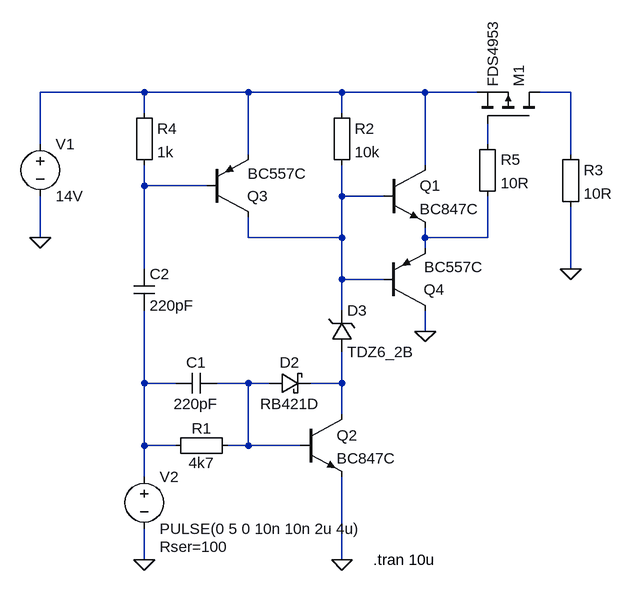
[diagram p0: schematic P-channel MOSFET shift_4_4_bjts.asc]
P-channel MOSFET shift_4_4_bjts.asc, the LTspice schematic file:
Version 4
SHEET 1 1044 680
WIRE -240 -144 -400 -144
WIRE -80 -144 -240 -144
WIRE 64 -144 -80 -144
WIRE 192 -144 64 -144
WIRE 272 -144 192 -144
WIRE 416 -144 368 -144
WIRE -240 -112 -240 -144
WIRE 64 -112 64 -144
WIRE -400 -64 -400 -144
WIRE 288 -64 288 -96
WIRE -80 -48 -80 -144
WIRE 416 -48 416 -144
WIRE 192 -32 192 -144
WIRE -240 0 -240 -32
WIRE -144 0 -240 0
WIRE 64 16 64 -32
WIRE 128 16 64 16
WIRE -400 80 -400 16
WIRE -80 80 -80 48
WIRE 64 80 64 16
WIRE 64 80 -80 80
WIRE 192 80 192 64
WIRE 288 80 288 16
WIRE 288 80 192 80
WIRE 192 96 192 80
WIRE -240 128 -240 0
WIRE 416 128 416 32
WIRE 64 144 64 80
WIRE 128 144 64 144
WIRE 64 192 64 144
WIRE 192 224 192 192
WIRE -240 304 -240 192
WIRE -192 304 -240 304
WIRE -80 304 -128 304
WIRE -48 304 -80 304
WIRE 64 304 64 256
WIRE 64 304 16 304
WIRE 64 352 64 304
WIRE -240 400 -240 304
WIRE -192 400 -240 400
WIRE -80 400 -80 304
WIRE -80 400 -112 400
WIRE 0 400 -80 400
WIRE -240 448 -240 400
WIRE -240 576 -240 528
WIRE 64 576 64 448
FLAG -400 80 0
FLAG 416 128 0
FLAG -240 576 0
FLAG 64 576 0
FLAG 192 224 0
SYMBOL npn 128 -32 R0
SYMATTR InstName Q1
SYMATTR Value BC847C
SYMBOL Misc\\EuropeanResistor 48 -128 R0
SYMATTR InstName R2
SYMATTR Value 10k
SYMBOL voltage -400 -80 R0
WINDOW 123 0 0 Left 2
WINDOW 39 0 0 Left 2
SYMATTR InstName V1
SYMATTR Value 14V
SYMBOL pmos 368 -96 M270
SYMATTR InstName M1
SYMATTR Value FDS4953
SYMBOL Misc\\EuropeanResistor 400 -64 R0
SYMATTR InstName R3
SYMATTR Value 10R
SYMBOL voltage -240 432 R0
WINDOW 123 0 0 Left 2
WINDOW 39 24 124 Left 2
SYMATTR SpiceLine Rser=100
SYMATTR InstName V2
SYMATTR Value PULSE(0 5 0 10n 10n 2u 4u)
SYMBOL zener 48 256 M180
WINDOW 0 24 64 Left 2
WINDOW 3 24 0 Left 2
SYMATTR InstName D3
SYMATTR Value TDZ6_2B
SYMATTR Description Diode
SYMATTR Type diode
SYMBOL npn 0 352 R0
SYMATTR InstName Q2
SYMATTR Value BC847C
SYMBOL Misc\\EuropeanResistor -96 384 R90
WINDOW 0 5 56 VBottom 2
WINDOW 3 27 56 VTop 2
SYMATTR InstName R1
SYMATTR Value 4k7
SYMBOL schottky -48 320 R270
WINDOW 0 32 32 VTop 2
WINDOW 3 0 32 VBottom 2
SYMATTR InstName D2
SYMATTR Value RB421D
SYMATTR Description Diode
SYMATTR Type diode
SYMBOL cap -128 288 R90
WINDOW 0 0 32 VBottom 2
WINDOW 3 32 32 VTop 2
SYMATTR InstName C1
SYMATTR Value 220pF
SYMBOL pnp -144 48 M180
WINDOW 0 62 32 Left 2
WINDOW 3 63 67 Left 2
SYMATTR InstName Q3
SYMATTR Value BC557C
SYMBOL Misc\\EuropeanResistor -256 -128 R0
SYMATTR InstName R4
SYMATTR Value 1k
SYMBOL cap -256 128 R0
SYMATTR InstName C2
SYMATTR Value 220pF
SYMBOL pnp 128 192 M180
WINDOW 0 62 32 Left 2
WINDOW 3 63 67 Left 2
SYMATTR InstName Q4
SYMATTR Value BC557C
SYMBOL Misc\\EuropeanResistor 272 -80 R0
SYMATTR InstName R5
SYMATTR Value 10R
TEXT 112 576 Left 2 !.tran 10u

The netlist it stands for:
* P-channel MOSFET shift_4_4_bjts.asc
Q1 N001 N005 N006 0 BC847C
R2 N001 N005 10k
V1 N001 0 14V
M1 N002 N003 N001 N001 FDS4953
R3 N002 0 10R
V2 N007 0 PULSE(0 5 0 10n 10n 2u 4u) Rser=100
D3 N009 N005 TDZ6_2B
Q2 N009 N008 0 0 BC847C
R1 N008 N007 4k7
D2 N008 N009 RB421D
C1 N008 N007 220pF
Q3 N005 N004 N001 0 BC557C
R4 N001 N004 1k
C2 N004 N007 220pF
Q4 0 N005 N006 0 BC557C
R5 N003 N006 10R
.model D D
.lib standard.dio
.model NPN NPN
.model PNP PNP
.lib standard.bjt
.model NMOS NMOS
.model PMOS PMOS
.lib standard.mos
.tran 10u
.backanno
.end